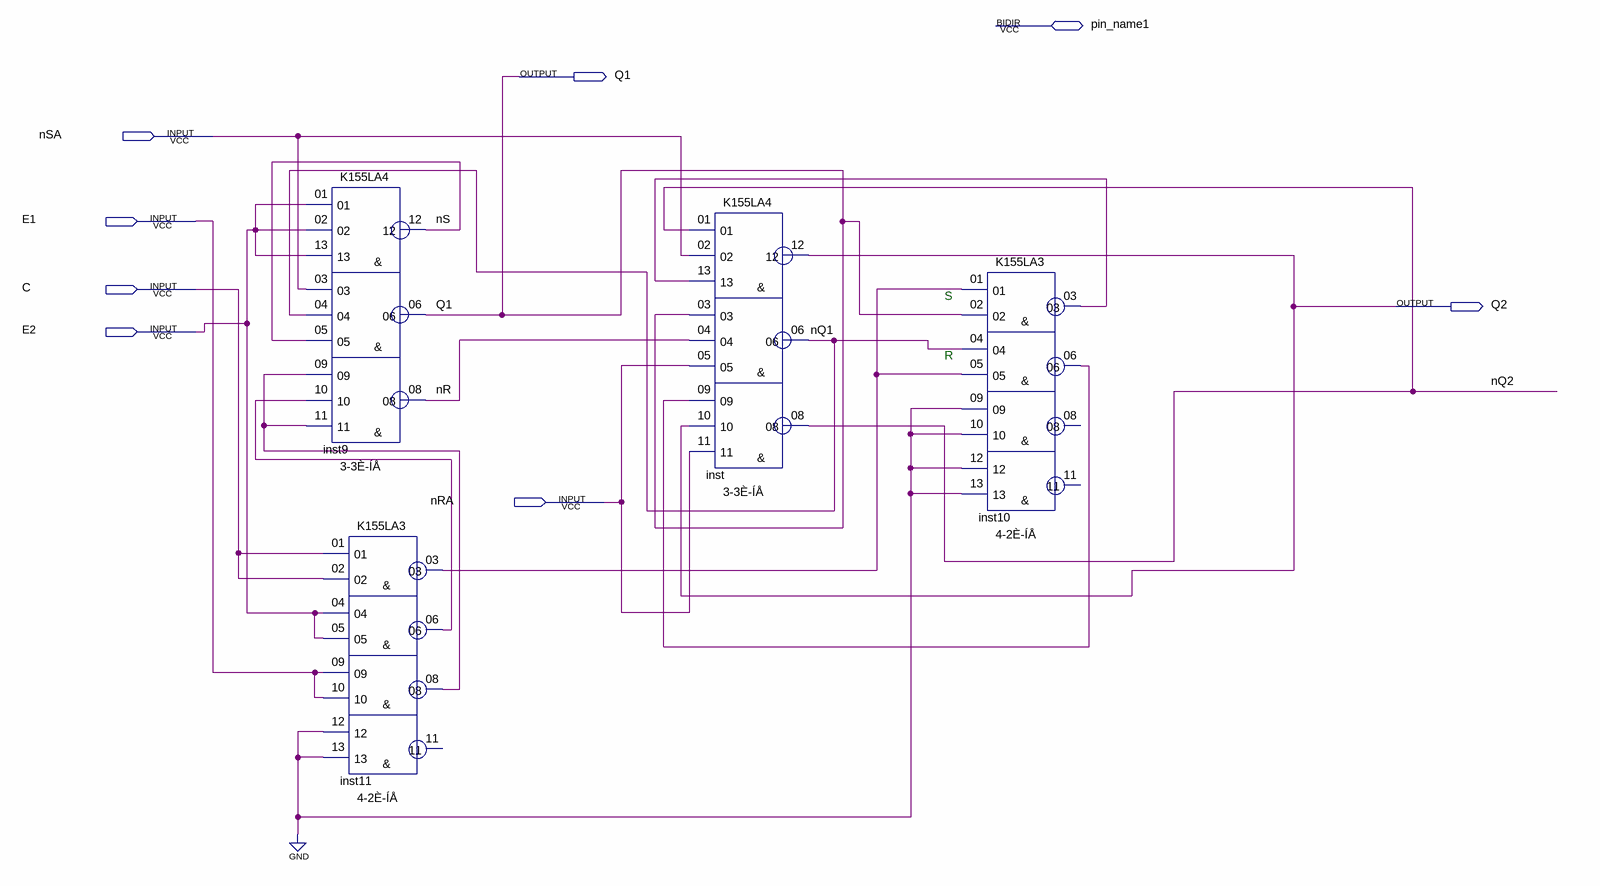
[diagram p0: schematic sheet]
// Quartus schematic lab3.bdf as structural Verilog: 4 symbols, 8 pins
module lab3 (
  input  nSA,
  input  E1,
  input  C,
  input  E2,
  input  nRA,
  inout  pin_name1,
  output Q1,
  output Q2
);

  wire inst10_03, inst10_06, inst11_03, inst11_06, inst11_08, nQ1, nQ2, nR, nS;

  K155LA4 inst9 (
    .\01 (E2), .\02 (E2), .\13 (E2), .\03 (nSA), .\04 (nQ1), .\05 (nS), .\09 (inst11_08), .\10 (inst11_06),
    .\11 (inst11_08), .\12 (nS), .\06 (Q1), .\08 (nR));
  K155LA3 inst11 (
    .\01 (C), .\02 (C), .\04 (E2), .\05 (E2), .\09 (E1), .\10 (E1), .\12 (1'b0), .\13 (1'b0),
    .\03 (inst11_03), .\06 (inst11_06), .\08 (inst11_08));  // open: 11
  K155LA4 inst (
    .\01 (nQ2), .\02 (nSA), .\13 (inst10_03), .\03 (Q1), .\04 (nR), .\05 (nRA), .\09 (inst10_06), .\10 (Q2),
    .\11 (nRA), .\12 (Q2), .\06 (nQ1), .\08 (nQ2));
  K155LA3 inst10 (
    .\01 (inst11_03), .\02 (Q1), .\04 (nQ1), .\05 (inst11_03), .\09 (1'b0), .\10 (1'b0), .\12 (1'b0),
    .\13 (1'b0), .\03 (inst10_03), .\06 (inst10_06));  // open: 08, 11

  // Notes on the sheet:
  //   S
  //   R
endmodule
